# EAGLE design DeviceRelay8 (EAGLE 5.00)
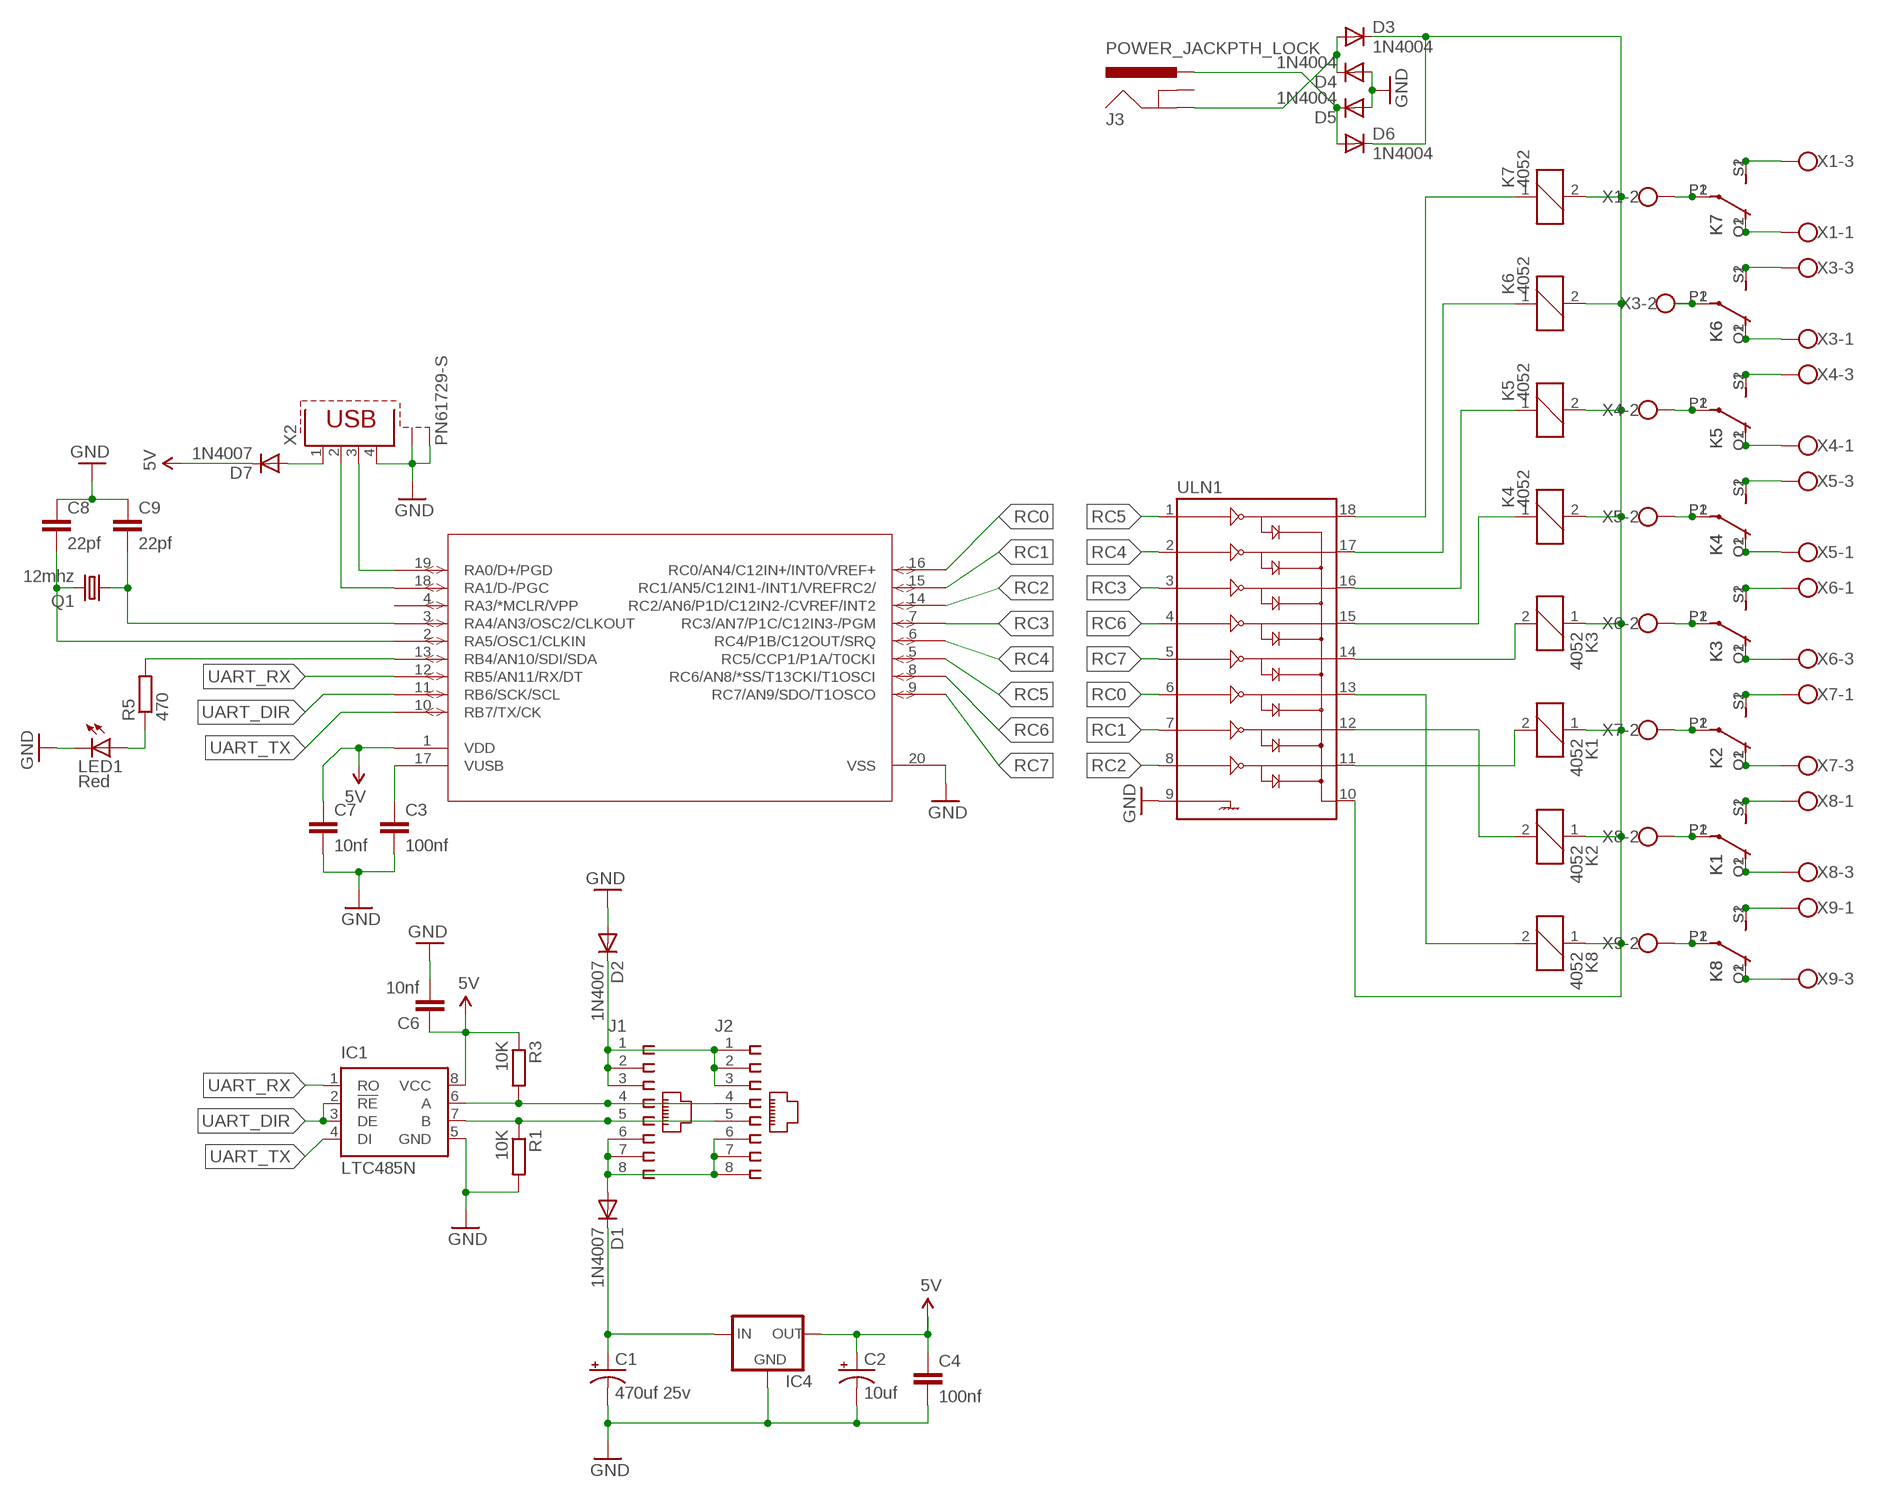
[diagram p0: schematic, sheet 1]

## Parts
C1  470uf 25v  CAP_POLPTH1  [CPOL-RADIAL-100UF-25V]
C2  10uf  CAP_POLPTH1  [CPOL-RADIAL-100UF-25V]
C3  100nf  C5/2.5  [C5B2.5]
C4  100nf  C5/2.5  [C5B2.5]
C6  10nf  C5/2.5  [C5B2.5]
C7  10nf  C5/2.5  [C5B2.5]
C8  22pf  C5/2.5  [C5B2.5]
C9  22pf  C5/2.5  [C5B2.5]
D1  1N4007  DIODE-D-7.5  [D-7.5]
D2  1N4007  DIODE-D-7.5  [D-7.5]
D3  1N4004  [DO41-10]
D4  1N4004  [DO41-10]
D5  1N4004  [DO41-10]
D6  1N4004  [DO41-10]
D7  1N4007  DIODE-D-7.5  [D-7.5]
IC1  LTC485N  [DIL08]
IC4  78XXL  [78XXL]
J1  215877-4  [215877-4]
J2  215877-4  [215877-4]
J3  POWER_JACKPTH_LOCK  [POWER_JACK_PTH_LOCK]
K1  4052  [F4052]
K2  4052  [F4052]
K3  4052  [F4052]
K4  4052  [F4052]
K5  4052  [F4052]
K6  4052  [F4052]
K7  4052  [F4052]
K8  4052  [F4052]
LED1  Red  LED5MM  [LED5MM]
Q1  12mhz  CRYSTALHC49U-V  [HC49U-V]
R1  10K  R-EU_0204/5  [0204/5]
R3  10K  R-EU_0204/5  [0204/5]
R5  470  R-EU_0207/7  [0207/7]
U$2  PIC18F14K50-E-P  [PIC18F14K50-E/P]
ULN1  ULN2803DIP  [DIL18]
X1  W237-103  [W237-103]
X2  PN61729-S  [PN61729-S]
X3  W237-103  [W237-103]
X4  W237-103  [W237-103]
X5  W237-103  [W237-103]
X6  W237-103  [W237-103]
X7  W237-103  [W237-103]
X8  W237-103  [W237-103]
X9  W237-103  [W237-103]

## Nets
5V: C2.1(+) C4.1 C6.1 C7.1 D7.C IC1.8(VCC) IC4.OUT R3.1 U$2.1(VDD)
GND: C1.2(-) C2.2(-) C3.2 C4.2 C6.2 C7.2 C8.1 C9.1 D2.A D4.A D5.A IC1.5(GND) IC4.GND LED1.K(C) R1.2 U$2.20(VSS) ULN1.9 X2.4 X2.S1 X2.S2
N$1: LED1.A R5.1
N$2: D1.A J1.6 J1.7 J1.8 J2.6 J2.7 J2.8
N$3: IC1.6(A) J1.4 J2.4 R3.2
N$4: R5.2 U$2.13(RB4/AN10/SDI/SDA)
N$5: C1.1(+) D1.C IC4.IN
N$9: D2.C J1.1 J1.2 J1.3 J2.1 J2.2 J2.3
N$11: U$2.18(RA1/D-/PGC) X2.2
N$12: C3.1 U$2.17(VUSB)
N$13: U$2.19(RA0/D+/PGD) X2.3
N$14: K1.2 ULN1.11
N$15: D7.A X2.1
N$17: K8.2 ULN1.13
N$18: D5.C D6.A J3.PWR
N$20: K4.1 ULN1.15
N$21: K5.1 ULN1.16
N$22: K6.1 ULN1.17
N$23: K2.2 ULN1.12
N$24: K7.1 ULN1.18
N$25: K7.S1(2:S) K7.S2(3:S) X1.3
N$26: K7.O1(2:O) K7.O2(3:O) X1.1
N$27: K7.P1(2:P) K7.P2(3:P) X1.2
N$28: K6.P1(2:P) K6.P2(3:P) X3.2
N$29: K5.P1(2:P) K5.P2(3:P) X4.2
N$30: K4.P1(2:P) K4.P2(3:P) X5.2
N$31: K2.P1(2:P) K2.P2(3:P) X7.2
N$32: K1.P1(2:P) K1.P2(3:P) X8.2
N$33: K8.P1(2:P) K8.P2(3:P) X9.2
N$34: K8.O1(2:O) K8.O2(3:O) X9.3
N$35: K8.S1(2:S) K8.S2(3:S) X9.1
N$36: K1.S1(2:S) K1.S2(3:S) X8.1
N$37: K2.O1(2:O) K2.O2(3:O) X7.3
N$38: K2.S1(2:S) K2.S2(3:S) X7.1
N$39: K3.O1(2:O) K3.O2(3:O) X6.3
N$40: K6.O1(2:O) K6.O2(3:O) X3.1
N$41: K6.S1(2:S) K6.S2(3:S) X3.3
N$42: K1.O1(2:O) K1.O2(3:O) X8.3
N$43: K3.S1(2:S) K3.S2(3:S) X6.1
N$44: K4.O1(2:O) K4.O2(3:O) X5.1
N$45: K4.S1(2:S) K4.S2(3:S) X5.3
N$46: K5.O1(2:O) K5.O2(3:O) X4.1
N$47: K5.S1(2:S) K5.S2(3:S) X4.3
N$48: K3.P1(2:P) K3.P2(3:P) X6.2
N$50: IC1.7(B) J1.5 J2.5 R1.1
N$52: C8.2 Q1.2 U$2.2(RA5/OSC1/CLKIN)
N$53: C9.2 Q1.1 U$2.3(RA4/AN3/OSC2/CLKOUT)
N$54: K3.2 ULN1.14
N$57: D3.C D6.C K1.1 K2.1 K3.1 K4.2 K5.2 K6.2 K7.2 K8.1 ULN1.10
N$70: D3.A D4.C J3.GND
RC0: U$2.16(RC0/AN4/C12IN+/INT0/VREF+) ULN1.6
RC1: U$2.15(RC1/AN5/C12IN1-/INT1/VREFRC2/) ULN1.7
RC2: U$2.14(RC2/AN6/P1D/C12IN2-/CVREF/INT2) ULN1.8
RC3: U$2.7(RC3/AN7/P1C/C12IN3-/PGM) ULN1.3
RC4: U$2.6(RC4/P1B/C12OUT/SRQ) ULN1.2
RC5: U$2.5(RC5/CCP1/P1A/T0CKI) ULN1.1
RC6: U$2.8(RC6/AN8/*SS/T13CKI/T1OSCI) ULN1.4
RC7: U$2.9(RC7/AN9/SDO/T1OSCO) ULN1.5
UART_DIR: IC1.2(!RE) IC1.3(DE) U$2.11(RB6/SCK/SCL)
UART_RX: IC1.1(RO) U$2.12(RB5/AN11/RX/DT)
UART_TX: IC1.4(DI) U$2.10(RB7/TX/CK)
Unconnected: J3.GNDBREAK U$2.4(RA3/*MCLR/VPP)

## Library data of the parts
C1 C2 = SparkFun:CAP_POL: Capacitor Polarized These are standard SMD and PTH capacitors. Normally 10uF, 47uF, and 100uF in electrolytic and tantalum varieties. Always verify the external diameter of the through hole cap, it varies with capacity, voltage, and manufacturer. The EIA devices should be standard.
C3 C4 C6-C9 = capacitor-wima:C: CAPACITOR naming: grid - package width
D1 D2 D7 = diode:DIODE-: DIODE
D3-D6 = diode:1N4004: DIODE general purpose rectifier, 1 A
IC1 = linear-technology:LTC485: Low Power RS485 Interface Transceiver Source: http://www.linear.com/pc/downloadDocument.do?navId=H0,C1,C1007,C1017,P2064,D1718
IC4 = v-reg:78XXL: VOLTAGE REGULATOR
J1 J2 = con-amp:215877-4: AMP connector
J3 = SparkFun:POWER_JACK: Power Jack This is the standard 5.5mm barrel jack for power. The PTH is the most common, proven, reliable, footprint. All others are experimental. The Slot footprint only works if the mill layer is transmitted to the PCB fab house so be warned. Spark Fun Electronics SKU : PRT-00119. Mating wall wart : TOL-00298 (and others)
K1-K8 = relay:4052: RELAY 2 x switch, Finder
LED1 = led:LED: LED OSRAM: - CHIPLED LG R971, LG N971, LY N971, LG Q971, LY Q971, LO R971, LY R971 LH N974, LH R974 LS Q976, LO Q976, LY Q976 LO Q996 - Hyper CHIPLED LW Q18S LB Q993, LB Q99A, LB R99A - SideLED LS A670, LO A670, LY A670, LG A670, LP A670 LB A673, LV A673, LT A673, LW A673 LH A674 LY A675 LS A676, LA A676, LO A676, LY A676, LW A676 LS A679, LY A679, LG A679 - Hyper Micro SIDELED® LS Y876, LA Y876, LO Y876, LY Y876 LT Y87S - SmartLED LW L88C, LW L88S LB L89C, LB L89S, LG L890 LS L89K, LO L89K, LY L89K LS L896, LA L896, LO L896, LY L896 - TOPLED LS T670, LO T670, LY T670, LG T670, LP T670 LSG T670, LSP T670, LSY T670, LOP T670, LYG T670 LG T671, LOG T671, LSG T671 LB T673, LV T673, LT T673, LW T673 LH T674 LS T676, LA T676, LO T676, LY T676, LB T676, LH T676, LSB T676, LW T676 LB T67C, LV T67C, LT T67C, LS T67K, LO T67K, LY T67K, LW E67C LS E67B, LA E67B, LO E67B, LY E67B, LB E67C, LV E67C, LT E67C LW T67C LS T679, LY T679, LG T679 LS T770, LO T770, LY T770, LG T770, LP T770 LB T773, LV T773, LT T773, LW T773 LH T774 LS E675, LA E675, LY E675, LS T675 LS T776, LA T776, LO T776, LY T776, LB T776 LHGB T686 LT T68C, LB T68C - Hyper Mini TOPLED® LB M676 - Mini TOPLED Santana® LG M470 LS M47K, LO M47K, LY M47K Source: http://www.osram.convergy.de LUXEON: - LUMILED® LXK2-PW12-R00, LXK2-PW12-S00, LXK2-PW14-U00, LXK2-PW14-V00 LXK2-PM12-R00, LXK2-PM12-S00, LXK2-PM14-U00 LXK2-PE12-Q00, LXK2-PE12-R00, LXK2-PE12-S00, LXK2-PE14-T00, LXK2-PE14-U00 LXK2-PB12-K00, LXK2-PB12-L00, LXK2-PB12-M00, LXK2-PB14-N00, LXK2-PB14-P00, LXK2-PB14-Q00 LXK2-PR12-L00, LXK2-PR12-M00, LXK2-PR14-Q00, LXK2-PR14-R00 LXK2-PD12-Q00, LXK2-PD12-R00, LXK2-PD12-S00 LXK2-PH12-R00, LXK2-PH12-S00 LXK2-PL12-P00, LXK2-PL12-Q00, LXK2-PL12-R00 Source: www.luxeon.com KINGBRIGHT: KA-3528ASYC Source: www.kingbright.com
Q1 = crystal:CRYSTAL: CRYSTAL
R1 R3 = resistor:R-EU_: RESISTOR, European symbol
R5 = rcl:R-EU_: RESISTOR, European symbol
U$2 = pic18f14k50:PIC18F14K50-E-P
ULN1 = SparkFun:ULN2803: Darlington Driver ULN2803 Darlington array. 500mA max per channel, 8-channel package. Spark Fun Electronics SKU : COM-00312
X1 X3-X9 = con-wago-500:W237-103: WAGO SCREW CLAMP
X2 = con-berg:PN61729-S: BERG USB connector

## Board
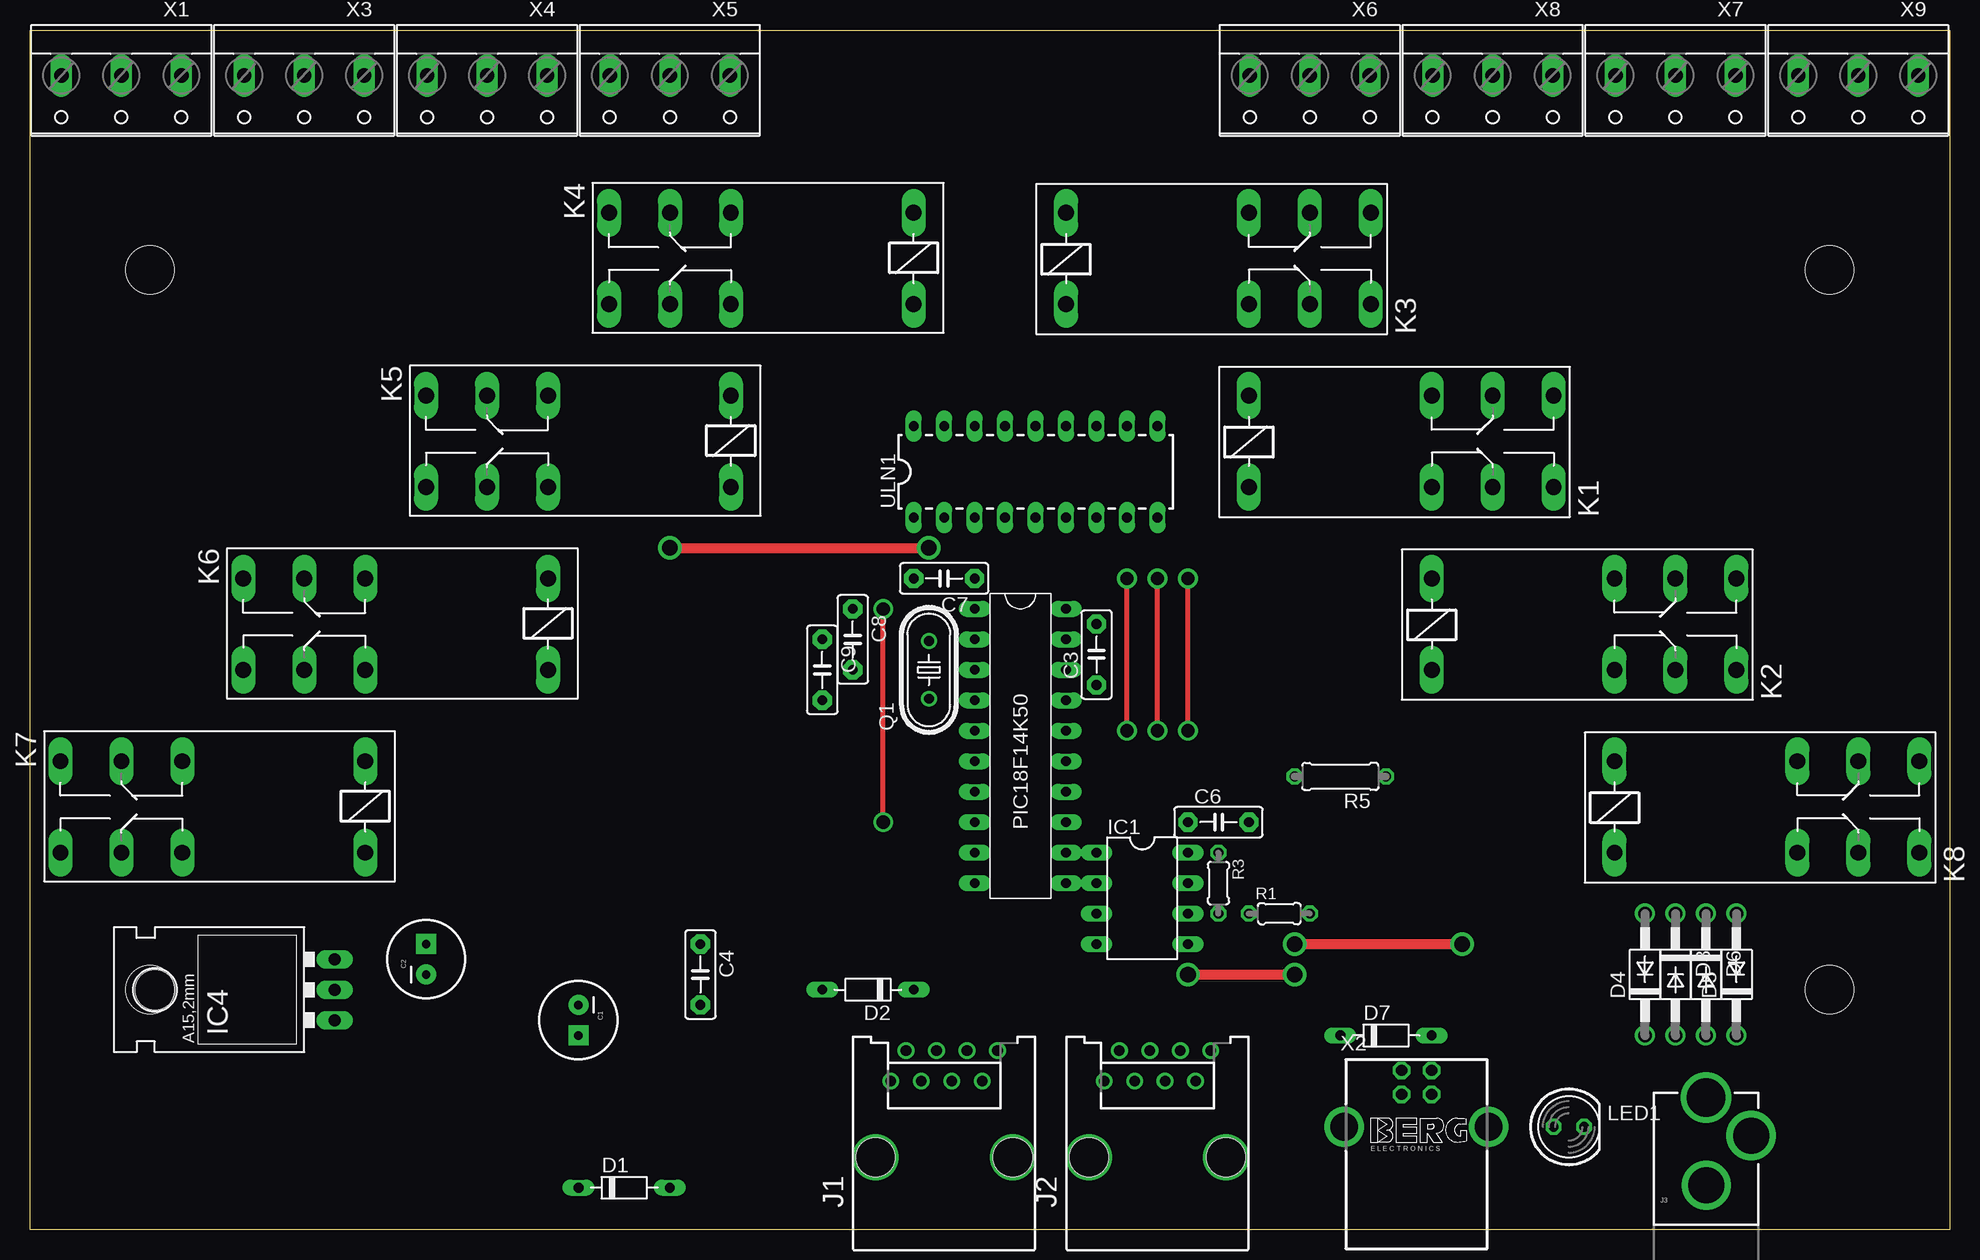
[diagram p1: board, top side]
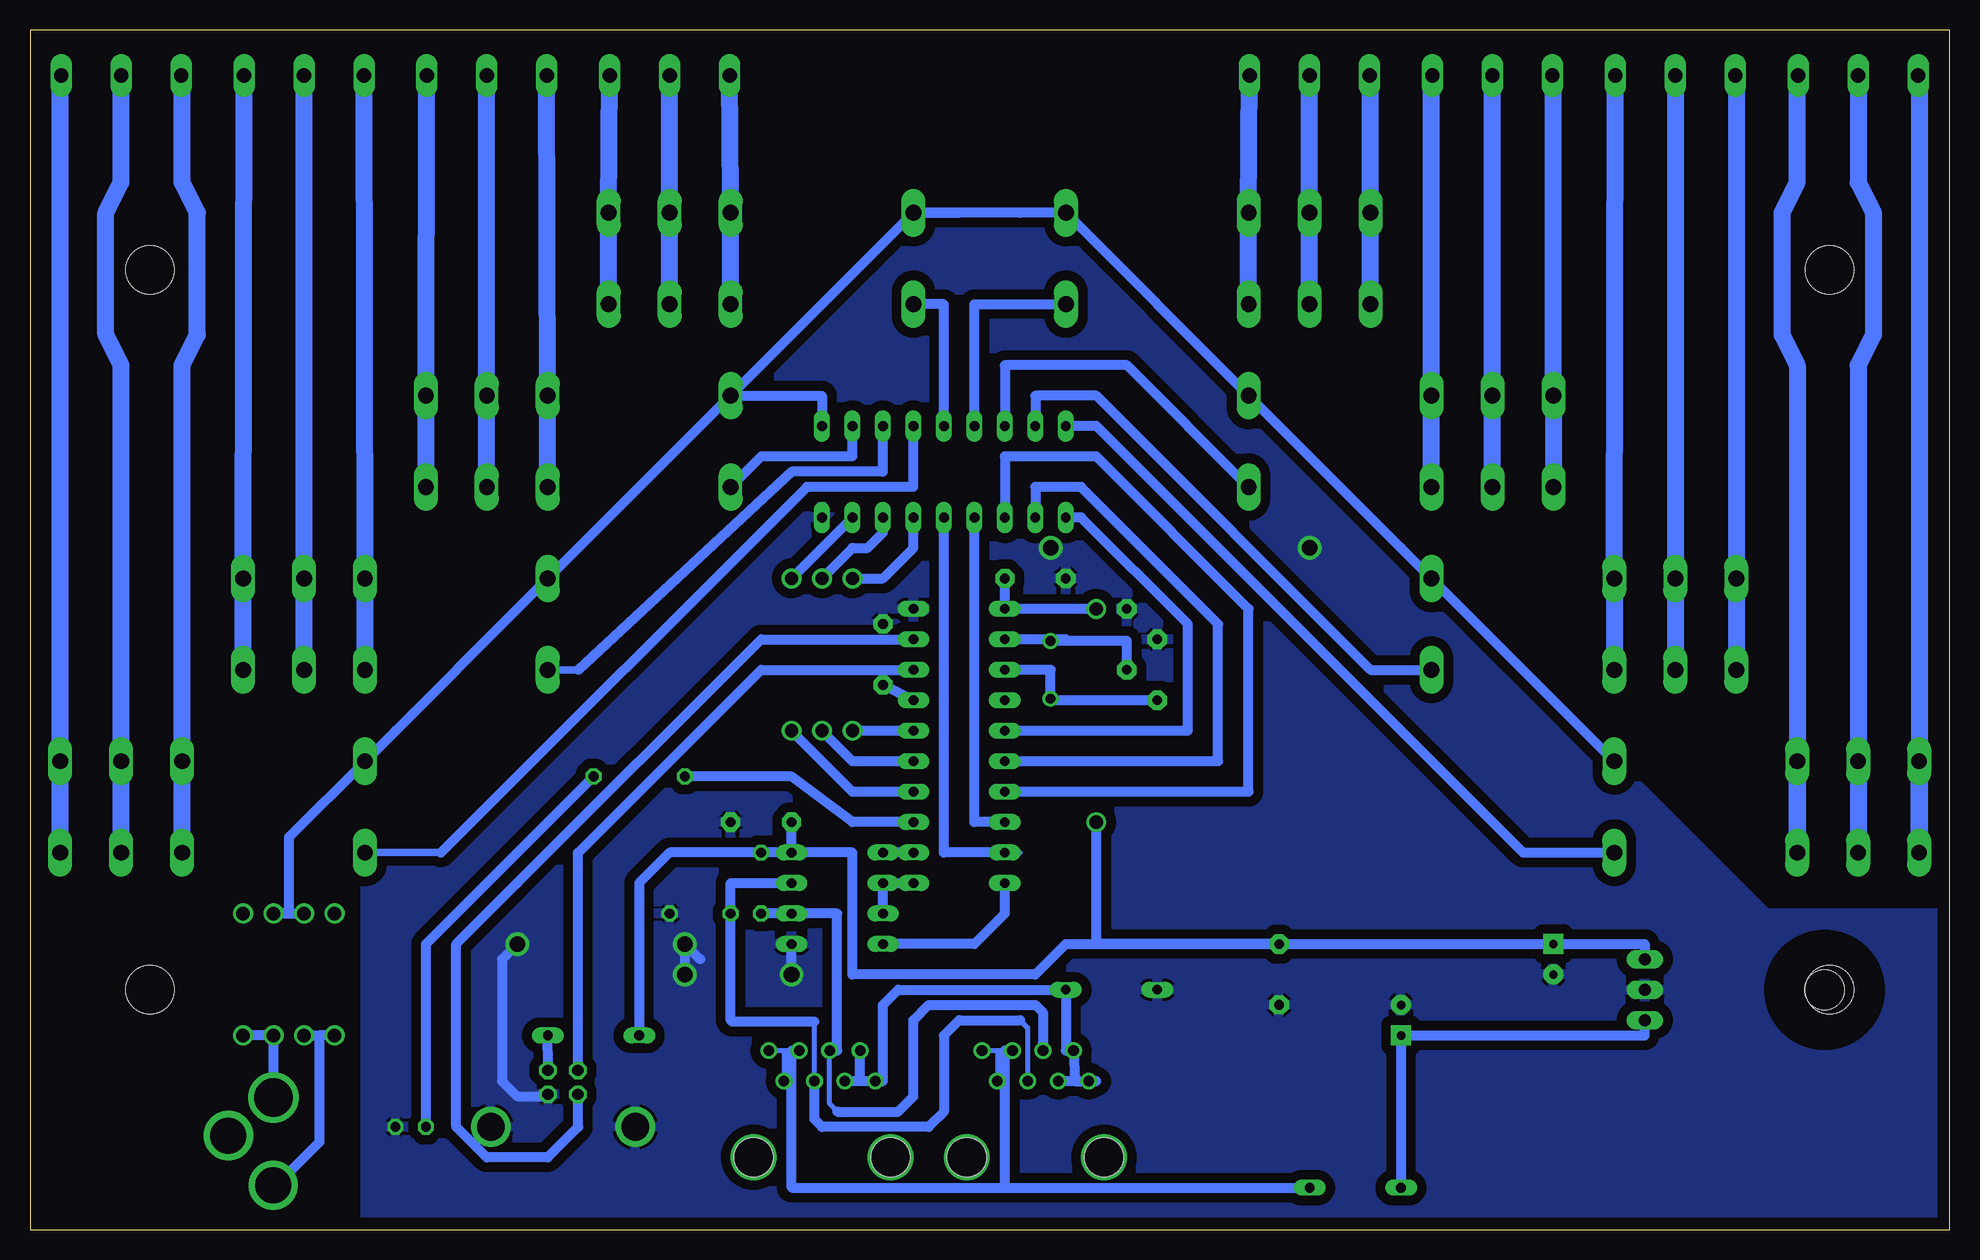
[diagram p2: board, bottom side, seen from below]

Size 160 x 100 mm. Coordinates in mm from the lower left corner, seen from the top.
Outline: 0,100 160,100 160,0 0,0 0,100
Copper layers (1*16): Top 0.035mm / dielectric 1.5mm / Bottom 0.035mm
Design rules "default": minimum track width 10mil, minimum drill 24mil, track to track 8mil, track to pad 8mil, pad to pad 8mil, via to via 8mil, smd to smd 8mil, copper to edge 40mil, drill to drill 8mil, minimum pad ring 10mil, minimum via ring 8mil, stop-mask expansion 4mil, vias tented up to drill 0mil, thermal gap 10mil
Holes 4 mm at 10,80 10,20 150,80 150,20

### Footprints (pad centres in the part's own frame; a part is rotated, then mirrored left to right if it is on the bottom)
CPOL-RADIAL-100UF-25V = drill 0.7 pad 1.651 square: 1 1.27,0 | drill 0.7 pad 1.651 round: 2 -1.27,0
C5B2.5 = drill 0.813 pad 1.6 octagon: 1 -2.54,0; 2 2.54,0
D-7.5 = drill 0.813 long: A 3.81,0; C -3.81,0
DO41-10 = drill 1.118 round: A 5.08,0; C -5.08,0
DIL08 = drill 0.813 long: 1 -3.81,-3.81; 2 -1.27,-3.81; 3 1.27,-3.81; 4 3.81,-3.81; 5 3.81,3.81; 6 1.27,3.81; 7 -1.27,3.81; 8 -3.81,3.81
78XXL = drill 1.016 long: GND 0,-3.81; IN -2.54,-3.81; OUT 2.54,-3.81 | hole 3.302: 0,11.176
215877-4 = drill 0.889 round: 1 -4.445,6.35; 2 -3.175,8.89; 3 -1.905,6.35; 4 -0.635,8.89; 5 0.635,6.35; 6 1.905,8.89; 7 3.175,6.35; 8 4.445,8.89 | hole 3.251: -5.715,0; 5.715,0
POWER_JACK_PTH_LOCK = drill 2.997 pad 4.115 round: GND 0.025,6.557; GNDBREAK 3.762,10.7 | drill 3.2 pad 4.115 round: PWR 0,13.878
F4052 = drill 1.321 long: 1 -3.81,3.81; 2 -3.81,-3.81; O1 11.43,-3.81; O2 11.43,3.81; P1 16.51,-3.81; P2 16.51,3.81; S1 21.59,-3.81; S2 21.59,3.81
LED5MM = drill 0.813 octagon: A -1.27,0; K 1.27,0
HC49U-V = drill 0.813 round: 1 -2.413,0; 2 2.413,0
0204/5 = drill 0.813 octagon: 1 -2.54,0; 2 2.54,0
0207/7 = drill 0.813 octagon: 1 -3.81,0; 2 3.81,0
PIC18F14K50-E/P = drill 0.813 long: 1 -5.08,12.7; 2 -5.08,10.16; 3 -5.08,7.62; 4 -5.08,5.08; 5 -5.08,2.54; 6 -5.08,0; 7 -5.08,-2.54; 8 -5.08,-5.08; 9 -5.08,-7.62; 10 -5.08,-10.16; 11 2.54,-10.16; 12 2.54,-7.62; 13 2.54,-5.08; 14 2.54,-2.54; 15 2.54,0; 16 2.54,2.54; 17 2.54,5.08; 18 2.54,7.62; 19 2.54,10.16; 20 2.54,12.7
DIL18 = drill 0.813 long: 1 -10.16,-3.81; 2 -7.62,-3.81; 3 -5.08,-3.81; 4 -2.54,-3.81; 5 0,-3.81; 6 2.54,-3.81; 7 5.08,-3.81; 8 7.62,-3.81; 9 10.16,-3.81; 10 10.16,3.81; 11 7.62,3.81; 12 5.08,3.81; 13 2.54,3.81; 14 0,3.81; 15 -2.54,3.81; 16 -5.08,3.81; 17 -7.62,3.81; 18 -10.16,3.81
W237-103 = drill 1.194 long: 1 -5,-1.29; 2 0,-1.29; 3 5,-1.29
PN61729-S = drill 0.95 octagon: 1 1.25,4.71; 2 -1.25,4.71; 3 -1.25,2.71; 4 1.25,2.71 | drill 2.3 pad 2.9 round: S1 -6.02,0; S2 6.02,0

### Placement (x,y rotation side)
C1  45.72,17.45 270 top
C2  33.02,22.53 90 top
C3  88.9,47.93 90 top
C4  55.88,21.26 270 top
C6  99.06,33.96 0 top
C7  76.2,54.28 180 top
C8  68.58,49.2 270 top
C9  66.04,46.66 270 top
D1  49.53,3.48 0 top
D2  69.85,19.99 180 top
D3  137.16,21.26 270 top
D4  134.62,21.26 90 top
D5  142.24,21.26 90 top
D6  139.7,21.26 270 top
D7  113.03,16.18 0 top
IC1  92.71,27.61 270 top
IC4  21.59,19.99 90 top
J1  76.2,6.02 0 top
J2  93.98,6.02 0 top
J3  139.7,-2.87 0 top
K1  105.41,65.71 0 top
K2  120.65,50.47 0 top
K3  90.17,80.95 0 top
K4  69.85,80.95 180 top
K5  54.61,65.71 180 top
K6  39.37,50.47 180 top
K7  24.13,35.23 180 top
K8  135.89,35.23 0 top
LED1  128.27,8.56 0 top
Q1  74.93,46.66 90 top
R1  104.14,26.34 0 top
R3  99.06,28.88 270 top
R5  109.22,37.77 180 top
U$2  83.82,39.04 0 top
ULN1  83.82,63.17 0 top
X1  7.62,94.92 180 top
X2  115.57,8.56 0 top
X3  22.86,94.92 180 top
X4  38.1,94.92 180 top
X5  53.34,94.92 180 top
X6  106.68,94.92 180 top
X7  137.16,94.92 180 top
X8  121.92,94.92 180 top
X9  152.4,94.92 180 top

### Tracks (layer width: path | path; a pad name or v marks a point on that pad's centre or on a via)
5V  (via drill 1.1)
  Top 0.406: v71.12,33.96 v71.12,51.74
  Bottom 0.406: R3.1 IC1.8 | 60.96,23.8 C4.1
  Bottom 0.813: IC4.OUT 25.4,23.8 C2.1 60.96,23.8 73.66,23.8 76.2,21.26 91.44,21.26 91.44,31.42 R3.1 106.68,31.42 109.22,28.88 D7.C | C4.1 71.12,23.8 v71.12,33.96 | U$2.1 v71.12,51.74 U$2.1 | IC1.8 C6.1 | U$2.1 C7.1
GND  (via drill 1.3)
  Top 0.813: v53.34,56.82 v74.93,56.82 | v96.52,21.26 v105.41,21.26 | v105.41,23.8 v119.38,23.8
  Bottom 0.406: 116.84,11.1 116.82,11.12 X2.4
  Bottom 0.813: v96.52,21.26 IC1.5 | v105.41,21.26 v105.41,23.8 104.14,22.53 | 116.82,11.12 119.4,11.12 120.65,12.37 120.65,22.53 v119.38,23.8
  pour Bottom (isolate 0.813): 0,26.34 15.24,26.34 73.66,84.76 86.36,84.76 132.08,39.04 132.08,-0.33 0,-0.33
N$1
  Bottom 0.813: LED1.A 127,23.8 R5.1
N$2
  Bottom 0.406: 79.38,14.91 J1.8 | 79.38,14.91 78.74,14.91 J1.6 | 79.38,14.91 J1.7 | 97.16,14.91 J2.7 | 97.16,14.91 J2.8 | J2.6 97.16,14.91
  Bottom 0.813: J2.6 96.52,14.91 96.52,3.48 78.74,3.48 | 78.74,3.48 78.74,14.91 | 78.74,3.48 D1.A
N$3
  Bottom 0.406: 75.56,15.55 J1.4 | J2.4 93.34,10.47 92.71,9.83
  Bottom 0.813: R3.2 IC1.6 92.71,26.34 92.71,14.91 J2.4 | 92.71,9.83 87.63,9.83 86.36,11.1 86.36,17.45 85.09,18.72 76.2,18.72 75.56,18.08 75.56,15.55
N$4
  Bottom 0.813: U$2.13 91.44,33.96 96.52,37.77 R5.2
N$5
  Bottom 0.813: IC4.IN 25.4,16.18 C1.1 D1.C
N$6  (via drill 2.8)
  other vias: 99.69,6.02
N$7  (via drill 2.8)
  other vias: 88.27,6.02
N$8  (via drill 2.8)
  other vias: 81.92,6.02
N$9
  Bottom 0.813: 90.81,12.37 J2.3 | 90.81,12.37 J2.2 | 90.81,12.37 J2.1 88.9,12.37 88.9,18.72 87.63,19.99 D2.C 73.66,14.91 J1.2 72.9,12.5 72.9,12.37 | 72.9,12.37 J1.3 | 71.12,12.37 J1.1 72.9,12.37
N$10  (via drill 2.8)
  other vias: 70.48,6.02
N$11
  Bottom 0.813: X2.2 114.32,31.4 99.06,46.66 U$2.18
N$12
  Bottom 0.813: U$2.17 C3.1
N$13
  Bottom 0.406: 114.3,11.1 114.32,11.12 X2.3
  Bottom 0.813: U$2.19 99.06,49.2 119.38,28.88 124.46,23.8 124.46,8.56 121.92,6.02 116.84,6.02 114.3,8.56 114.32,8.58 114.32,11.12
N$14
  Bottom 0.813: ULN1.11 91.44,64.44 99.06,64.44 K1.2
N$15
  Bottom 0.406: X2.1 116.82,13.62
  Bottom 0.813: 116.82,13.62 D7.A
N$17
  Bottom 0.61: 125.73,31.42 K8.2
  Bottom 0.813: ULN1.13 86.36,61.9 95.25,61.9 125.73,31.42
N$18
  Bottom 0.813: D5.C D6.A J3.PWR
N$20
  Bottom 0.813: ULN1.15 81.28,77.14 K4.1
N$21
  Bottom 0.813: ULN1.16 78.74,72.06 68.58,72.06 K5.1
N$22
  Bottom 0.813: ULN1.17 76.2,69.52 71.12,69.52 48.26,46.66 K6.1
N$23
  Bottom 0.61: 114.3,46.66 K2.2
  Bottom 0.813: ULN1.12 88.9,63.17 96.52,63.17 114.3,46.66
N$24
  Bottom 0.813: ULN1.18 71.12,66.98 35.56,31.42 K7.1
N$25
  Bottom 1.422: K7.S1 K7.S2 2.54,96.19 X1.3
N$26
  Bottom 1.422: K7.O1 K7.O2 12.7,72.06 13.97,74.6 13.97,84.76 12.7,87.3 12.7,96.19 X1.1
N$27
  Bottom 1.422: K7.P2 K7.P1 7.62,72.06 6.35,74.6 6.35,84.76 7.62,87.3 X1.2
N$28
  Bottom 1.422: K6.P2 K6.P1 X3.2
N$29
  Bottom 1.422: K5.P2 K5.P1 X4.2
N$30
  Bottom 1.422: K4.P2 K4.P1 X5.2
N$31
  Bottom 1.422: K2.P1 K2.P2 X7.2
N$32
  Bottom 1.422: K1.P1 K1.P2 X8.2
N$33
  Bottom 1.422: K8.P1 K8.P2 152.4,72.06 153.67,74.6 153.67,84.76 152.4,87.3 X9.2
N$34
  Bottom 1.422: K8.O1 K8.O2 147.32,72.06 146.05,74.6 146.05,84.76 147.32,87.3 147.32,96.19 X9.3
N$35
  Bottom 1.422: K8.S1 K8.S2 157.48,96.19 X9.1
N$36
  Bottom 1.422: K1.S1 K1.S2 X8.1
N$37
  Bottom 1.422: K2.O1 K2.O2 X7.3
N$38
  Bottom 1.422: K2.S1 K2.S2 X7.1
N$39
  Bottom 1.422: K3.O1 K3.O2 101.6,86.03 X6.3
N$40
  Bottom 1.422: K6.O2 K6.O1 X3.1
N$41
  Bottom 1.422: K6.S2 K6.S1 17.78,96.19 X3.3
N$42
  Bottom 1.422: K1.O1 K1.O2 X8.3
N$43
  Bottom 1.422: K3.S1 K3.S2 X6.1
N$44
  Bottom 1.422: K4.O2 K4.O1 X5.1
N$45
  Bottom 1.422: K4.S2 K4.S1 48.26,96.19 X5.3
N$46
  Bottom 1.422: K5.O2 K5.O1 43.18,96.19 X4.1
N$47
  Bottom 1.422: K5.S2 K5.S1 33.02,96.19 X4.3
N$48
  Bottom 1.422: K3.P1 K3.P2 X6.2
N$50
  Bottom 0.406: J2.5 94.61,17.32 | J1.5 76.83,16.81 77.47,17.45
  Bottom 0.813: 77.47,17.45 82.55,17.45 83.82,16.18 83.82,9.83 85.09,8.56 93.98,8.56 94.61,9.19 J2.5 | 94.61,17.32 101.47,17.32 101.6,17.45 R1.1 101.6,28.88 IC1.7
N$52
  Bottom 0.406: Q1.2 73.66,49.2
  Bottom 0.813: 73.66,49.2 U$2.2 | C8.2 68.58,49.07 Q1.2
N$53
  Bottom 0.406: 74.93,46.66 Q1.1
  Bottom 0.813: C9.2 74.93,44.12 74.93,46.66 U$2.3
N$54
  Bottom 0.813: ULN1.14 83.82,77.14 K3.2
N$57
  Bottom 0.813: K6.2 K5.2 | K6.2 K7.2 30.48,41.58 | K5.2 K4.2 | K4.2 K3.1 | K3.1 K1.1 | K8.1 K2.1 K1.1 | K8.1 138.43,32.69 138.43,26.34 D6.C D3.C | K5.2 60.96,72.06 | K4.2 77.47,84.76 | K3.1 82.55,84.76 | K8.1 129.54,41.58 | K6.2 45.72,56.82 | ULN1.10 93.98,69.52 K1.1
N$70
  Bottom 0.813: D4.C 135.89,16.18 | D3.A 135.89,16.18 | 135.89,16.18 135.89,7.29 139.7,3.48 139.72,3.5 J3.GND
RC0  (via drill 1.1)
  Top 0.406: v91.44,41.58 v91.44,54.28
  Bottom 0.813: v91.44,54.28 88.9,54.28 86.36,56.82 ULN1.6 | U$2.16 v91.44,41.58
RC1  (via drill 1.1)
  Top 0.406: v93.98,41.58 v93.98,54.28
  Bottom 0.813: v93.98,41.58 91.44,39.04 U$2.15 | v93.98,54.28 91.44,56.82 90.17,56.82 88.9,58.09 ULN1.7
RC2  (via drill 1.1)
  Top 0.406: v96.52,41.58 v96.52,54.28
  Bottom 0.813: v96.52,54.28 ULN1.8 | U$2.14 91.44,36.5 v96.52,41.58
RC3
  Bottom 0.813: U$2.7 58.42,36.5 58.42,51.74 71.12,64.44 78.74,64.44 ULN1.3
RC4
  Bottom 0.813: U$2.6 60.96,39.04 60.96,50.47 72.39,61.9 76.2,61.9 ULN1.2
RC5
  Bottom 0.813: U$2.5 63.5,41.58 63.5,50.47 72.39,59.36 ULN1.1
RC6
  Bottom 0.406: 81.28,58.09 ULN1.4
  Bottom 0.813: U$2.8 81.28,33.96 81.28,58.09
RC7
  Bottom 0.406: 77.47,31.42 U$2.9
  Bottom 0.813: U$2.9 83.82,31.42 ULN1.5
UART_DIR
  Bottom 0.813: IC1.3 IC1.2 U$2.11
UART_RX
  Bottom 0.813: U$2.12 IC1.1
UART_TX
  Bottom 0.813: U$2.10 78.74,26.34 81.28,23.8 IC1.4
(copper drawn outside any net)
  shapes: Bottom circle x4